# Altium schematic sheet CardSlot.SchDoc: Slot for DA-Card
size A4; DocumentNumber: 5; SheetNumber: 5; SheetTotal: 16
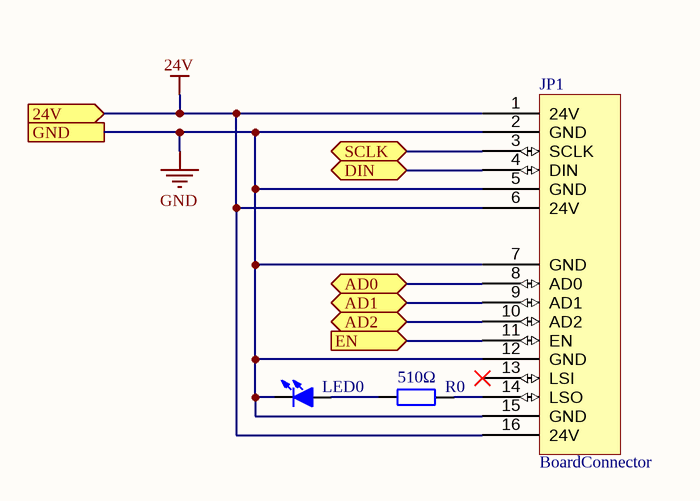
[diagram p0: CardSlot.SchDoc]

## Parts
JP1  BoardConnector  [HDR2.54-DIY16-N]
LED0  White  [LED 0603W]  (value not drawn)
R0  510Ω  [R 0603_L]

## Ports
24V (in), AD0 (bidir), AD1 (bidir), AD2 (bidir), DIN (bidir), EN (in), GND, SCLK (bidir)

## Nets
24V: JP1.1(24V) JP1.6(24V) JP1.16(24V) ; port 24V
GND: JP1.2(GND) JP1.5(GND) JP1.7(GND) JP1.12(GND) JP1.15(GND) LED0.2(K) ; port GND
AD0: JP1.8(AD0) ; port AD0
AD1: JP1.9(AD1) ; port AD1
AD2: JP1.10(AD2) ; port AD2
DIN: JP1.4(DIN) ; port DIN
EN: JP1.11(EN) ; port EN
SCLK: JP1.3(SCLK) ; port SCLK
NetJP1_14: JP1.14(LSO) R0.2
NetLED0_1: LED0.1(A) R0.1

Not connected (* = marked no-connect by the designer): JP1 13(LSI)*

## Notes on the sheet
- Title
- FileName:
- Version:
- Date:
- Project
- Designed By:
- Descriptions:
- Sheet:
- of

## Library data of the parts
JP1 = BoardConnector: DIY Board Connector (P/N); System: Connector
LED0 = LED-SMD: 贴片LED; 版权归属: 封装库来自淘宝 ID：黄晶宝石; BOM名称: 贴片LED; 学习资源: https://shop463601444.taobao.com
R0 = R: 贴片电阻; 版权归属: 来自淘宝 ID：黄晶宝石; 封装库来自淘宝卖家 ID：黄晶宝石: 其他店铺购入均为盗版，不享受售后技术支持服务，请立即申请退款; BOM名称: 贴片电阻; 联系售后: https://shop463601444.taobao.com